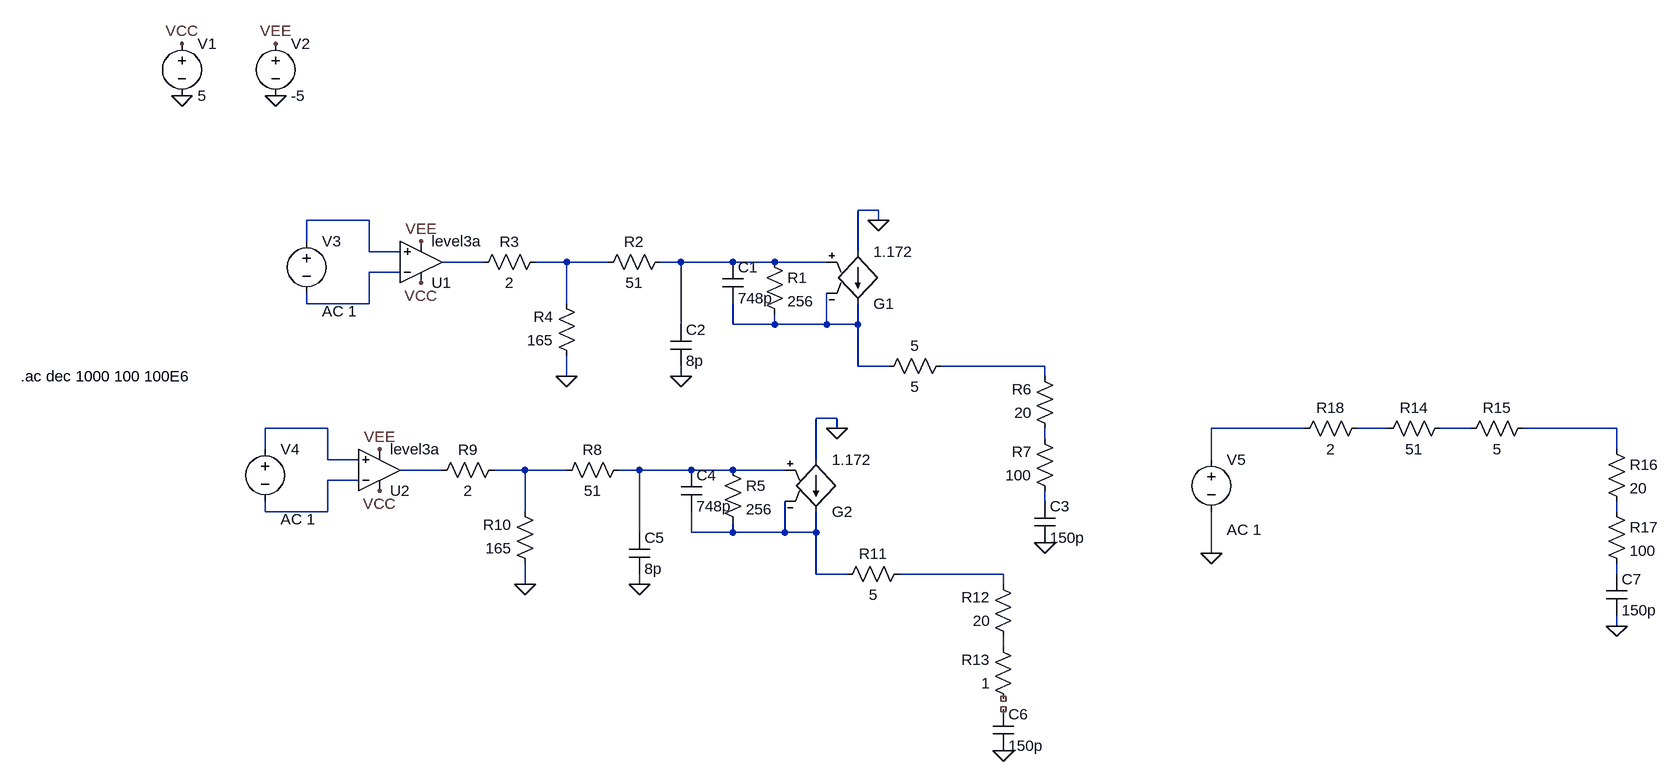
[diagram p0: schematic DAC_STABILITY.asc]
DAC_STABILITY.asc, the LTspice schematic file:
Version 4
SHEET 1 2100 1060
WIRE 896 208 864 208
WIRE 112 224 16 224
WIRE 896 224 896 208
WIRE 16 256 16 224
WIRE 112 272 112 224
WIRE 160 272 112 272
WIRE 864 272 864 208
WIRE 288 288 224 288
WIRE 416 288 368 288
WIRE 480 288 416 288
WIRE 592 288 560 288
WIRE 672 288 592 288
WIRE 736 288 672 288
WIRE 816 288 736 288
WIRE 160 304 112 304
WIRE 16 352 16 336
WIRE 112 352 112 304
WIRE 112 352 16 352
WIRE 416 352 416 288
WIRE 592 384 592 288
WIRE 672 384 672 352
WIRE 736 384 736 368
WIRE 736 384 672 384
WIRE 816 384 816 336
WIRE 816 384 736 384
WIRE 864 384 864 352
WIRE 864 384 816 384
WIRE 864 448 864 384
WIRE 912 448 864 448
WIRE 1152 448 992 448
WIRE 416 464 416 432
WIRE 592 464 592 448
WIRE 1152 464 1152 448
WIRE 832 528 800 528
WIRE 48 544 -48 544
WIRE 832 544 832 528
WIRE 1552 544 1408 544
WIRE 1680 544 1632 544
WIRE 1808 544 1760 544
WIRE 2032 544 1888 544
WIRE 1152 560 1152 544
WIRE -48 576 -48 544
WIRE 2032 576 2032 544
WIRE 48 592 48 544
WIRE 96 592 48 592
WIRE 800 592 800 528
WIRE 1408 592 1408 544
WIRE 224 608 160 608
WIRE 352 608 304 608
WIRE 416 608 352 608
WIRE 528 608 496 608
WIRE 608 608 528 608
WIRE 672 608 608 608
WIRE 752 608 672 608
WIRE 96 624 48 624
WIRE 1152 656 1152 640
WIRE -48 672 -48 656
WIRE 48 672 48 624
WIRE 48 672 -48 672
WIRE 352 672 352 608
WIRE 2032 672 2032 656
WIRE 528 704 528 608
WIRE 608 704 608 672
WIRE 672 704 672 688
WIRE 672 704 608 704
WIRE 752 704 752 656
WIRE 752 704 672 704
WIRE 800 704 800 672
WIRE 800 704 752 704
WIRE 1408 736 1408 672
WIRE 800 768 800 704
WIRE 848 768 800 768
WIRE 1088 768 928 768
WIRE 2032 768 2032 752
WIRE 352 784 352 752
WIRE 528 784 528 768
WIRE 1088 784 1088 768
WIRE 2032 848 2032 832
WIRE 1088 880 1088 864
FLAG 192 320 VCC
FLAG -176 -48 VCC
FLAG -32 -48 VEE
FLAG 192 256 VEE
FLAG 416 464 0
FLAG 592 464 0
FLAG 896 224 0
FLAG 1152 720 0
FLAG -32 32 0
FLAG -176 32 0
FLAG 128 640 VCC
FLAG 128 576 VEE
FLAG 352 784 0
FLAG 528 784 0
FLAG 832 544 0
FLAG 1088 1040 0
FLAG 1408 736 0
FLAG 2032 848 0
SYMBOL voltage -176 -64 R0
WINDOW 123 0 0 Left 0
WINDOW 39 0 0 Left 0
SYMATTR InstName V1
SYMATTR Value 5
SYMBOL voltage -32 -64 R0
WINDOW 123 0 0 Left 0
WINDOW 39 0 0 Left 0
SYMATTR InstName V2
SYMATTR Value -5
SYMBOL OpAmps\\UniversalOpAmp3 192 288 M180
SYMATTR InstName U1
SYMATTR Value2 Avol=10000 GBW=80Meg Slew=10Meg
SYMATTR SpiceLine Ilimit=25m Rail=0 Vos=0 Phimargin=30
SYMBOL voltage 16 240 R0
WINDOW 123 24 124 Left 2
WINDOW 39 0 0 Left 0
SYMATTR Value2 AC 1
SYMATTR InstName V3
SYMATTR Value ""
SYMBOL g2 864 368 M180
SYMATTR InstName G1
SYMATTR Value 1.172
SYMBOL res 720 272 R0
SYMATTR InstName R1
SYMATTR Value 256
SYMBOL cap 656 288 R0
SYMATTR InstName C1
SYMATTR Value 748p
SYMBOL res 576 272 R90
WINDOW 0 0 56 VBottom 2
WINDOW 3 32 56 VTop 2
SYMATTR InstName R2
SYMATTR Value 51
SYMBOL res 384 272 R90
WINDOW 0 0 56 VBottom 2
WINDOW 3 32 56 VTop 2
SYMATTR InstName R3
SYMATTR Value 2
SYMBOL res 432 448 R180
WINDOW 0 36 76 Left 2
WINDOW 3 36 40 Left 2
SYMATTR InstName R4
SYMATTR Value 165
SYMBOL cap 576 384 R0
SYMATTR InstName C2
SYMATTR Value 8p
SYMBOL res 1008 432 R90
WINDOW 0 0 56 VBottom 2
WINDOW 3 32 56 VTop 2
SYMATTR InstName 5
SYMATTR Value 5
SYMBOL res 1168 560 R180
WINDOW 0 36 76 Left 2
WINDOW 3 36 40 Left 2
SYMATTR InstName R6
SYMATTR Value 20
SYMBOL res 1168 656 R180
WINDOW 0 36 76 Left 2
WINDOW 3 36 40 Left 2
SYMATTR InstName R7
SYMATTR Value 100
SYMBOL cap 1136 656 R0
SYMATTR InstName C3
SYMATTR Value 150p
SYMBOL OpAmps\\UniversalOpAmp3 128 608 M180
SYMATTR InstName U2
SYMATTR Value2 Avol=10000 GBW=80Meg Slew=10Meg
SYMATTR SpiceLine Ilimit=25m Rail=0 Vos=0 Phimargin=30
SYMBOL voltage -48 560 R0
WINDOW 123 24 124 Left 2
WINDOW 39 0 0 Left 0
SYMATTR Value2 AC 1
SYMATTR InstName V4
SYMATTR Value ""
SYMBOL g2 800 688 M180
SYMATTR InstName G2
SYMATTR Value 1.172
SYMBOL res 656 592 R0
SYMATTR InstName R5
SYMATTR Value 256
SYMBOL cap 592 608 R0
SYMATTR InstName C4
SYMATTR Value 748p
SYMBOL res 512 592 R90
WINDOW 0 0 56 VBottom 2
WINDOW 3 32 56 VTop 2
SYMATTR InstName R8
SYMATTR Value 51
SYMBOL res 320 592 R90
WINDOW 0 0 56 VBottom 2
WINDOW 3 32 56 VTop 2
SYMATTR InstName R9
SYMATTR Value 2
SYMBOL res 368 768 R180
WINDOW 0 36 76 Left 2
WINDOW 3 36 40 Left 2
SYMATTR InstName R10
SYMATTR Value 165
SYMBOL cap 512 704 R0
SYMATTR InstName C5
SYMATTR Value 8p
SYMBOL res 944 752 R90
WINDOW 0 0 56 VBottom 2
WINDOW 3 32 56 VTop 2
SYMATTR InstName R11
SYMATTR Value 5
SYMBOL res 1104 880 R180
WINDOW 0 36 76 Left 2
WINDOW 3 36 40 Left 2
SYMATTR InstName R12
SYMATTR Value 20
SYMBOL res 1104 976 R180
WINDOW 0 36 76 Left 2
WINDOW 3 36 40 Left 2
SYMATTR InstName R13
SYMATTR Value 1
SYMBOL cap 1072 976 R0
SYMATTR InstName C6
SYMATTR Value 150p
SYMBOL voltage 1408 576 R0
WINDOW 123 24 124 Left 2
WINDOW 39 0 0 Left 0
SYMATTR Value2 AC 1
SYMATTR InstName V5
SYMATTR Value ""
SYMBOL res 1776 528 R90
WINDOW 0 0 56 VBottom 2
WINDOW 3 32 56 VTop 2
SYMATTR InstName R14
SYMATTR Value 51
SYMBOL res 1904 528 R90
WINDOW 0 0 56 VBottom 2
WINDOW 3 32 56 VTop 2
SYMATTR InstName R15
SYMATTR Value 5
SYMBOL res 2016 560 R0
SYMATTR InstName R16
SYMATTR Value 20
SYMBOL res 2016 656 R0
SYMATTR InstName R17
SYMATTR Value 100
SYMBOL cap 2016 768 R0
SYMATTR InstName C7
SYMATTR Value 150p
SYMBOL res 1648 528 R90
WINDOW 0 0 56 VBottom 2
WINDOW 3 32 56 VTop 2
SYMATTR InstName R18
SYMATTR Value 2
TEXT -424 464 Left 2 !.ac dec 1000 100 100E6

The netlist it stands for:
* DAC_STABILITY.asc
V1 VCC 0 5
V2 VEE 0 -5
XU1 N001 N005 VCC VEE N002 level3a Avol=10000 GBW=80Meg Slew=10Meg Ilimit=25m Rail=0 Vos=0 Phimargin=30  ; pins In+ In- V+ V- OUT
V3 N001 N005 AC 1
G1 0 N006 N004 N006 1.172
R1 N004 N006 256
C1 N004 N006 748p
R2 N004 N003 51
R3 N003 N002 2
R4 0 N003 165
C2 N004 0 8p
R§5 N007 N006 5
R6 N013 N007 20
R7 N018 N013 100
C3 N018 0 150p
XU2 N008 N017 VCC VEE N014 level3a Avol=10000 GBW=80Meg Slew=10Meg Ilimit=25m Rail=0 Vos=0 Phimargin=30  ; pins In+ In- V+ V- OUT
V4 N008 N017 AC 1
G2 0 N020 N016 N020 1.172
R5 N016 N020 256
C4 N016 N020 748p
R8 N016 N015 51
R9 N015 N014 2
R10 0 N015 165
C5 N016 0 8p
R11 N021 N020 5
R12 N023 N021 20
R13 NC_01 N023 1
C6 NC_02 0 150p
V5 N009 0 AC 1
R14 N011 N010 51
R15 N012 N011 5
R16 N012 N019 20
R17 N019 N022 100
C7 N022 0 150p
R18 N010 N009 2
.ac dec 1000 100 100E6
.backanno
.end